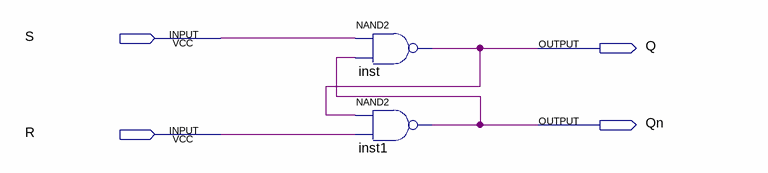
[diagram p0: schematic sheet]
// Quartus schematic lab9step2.bdf as structural Verilog: 2 symbols, 4 pins
module lab9step2 (
  input  S,
  input  R,
  output Q,
  output Qn
);

  nand inst (Q, S, Qn);
  nand inst1 (Qn, Q, R);
endmodule
